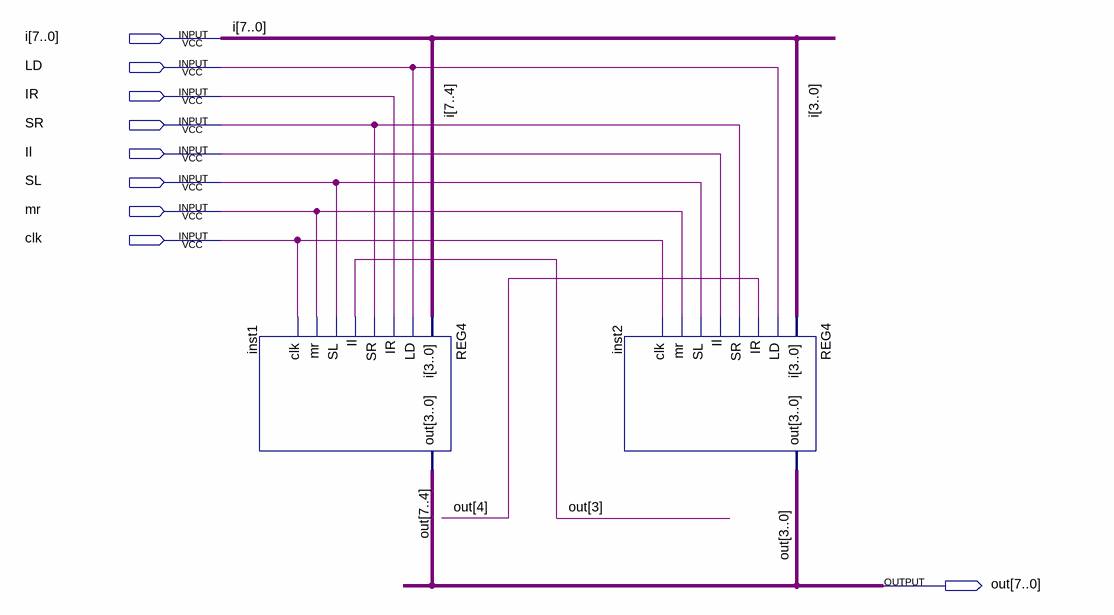
[diagram p0: schematic sheet]
// Quartus schematic REG8.bdf as structural Verilog: 2 symbols, 9 pins
module REG8 (
  input  [7:0] i,
  input  LD,
  input  IR,
  input  SR,
  input  Il,
  input  SL,
  input  mr,
  input  clk,
  output [7:0] out
);

  REG4 inst1 (.i(i[7:4]), .LD(LD), .IR(IR), .SR(SR), .Il(out[3]), .SL(SL), .mr(mr), .clk(clk), .out(out[7:4]));
  REG4 inst2 (.i(i[3:0]), .LD(LD), .IR(out[4]), .SR(SR), .Il(Il), .SL(SL), .mr(mr), .clk(clk), .out(out[3:0]));
endmodule
